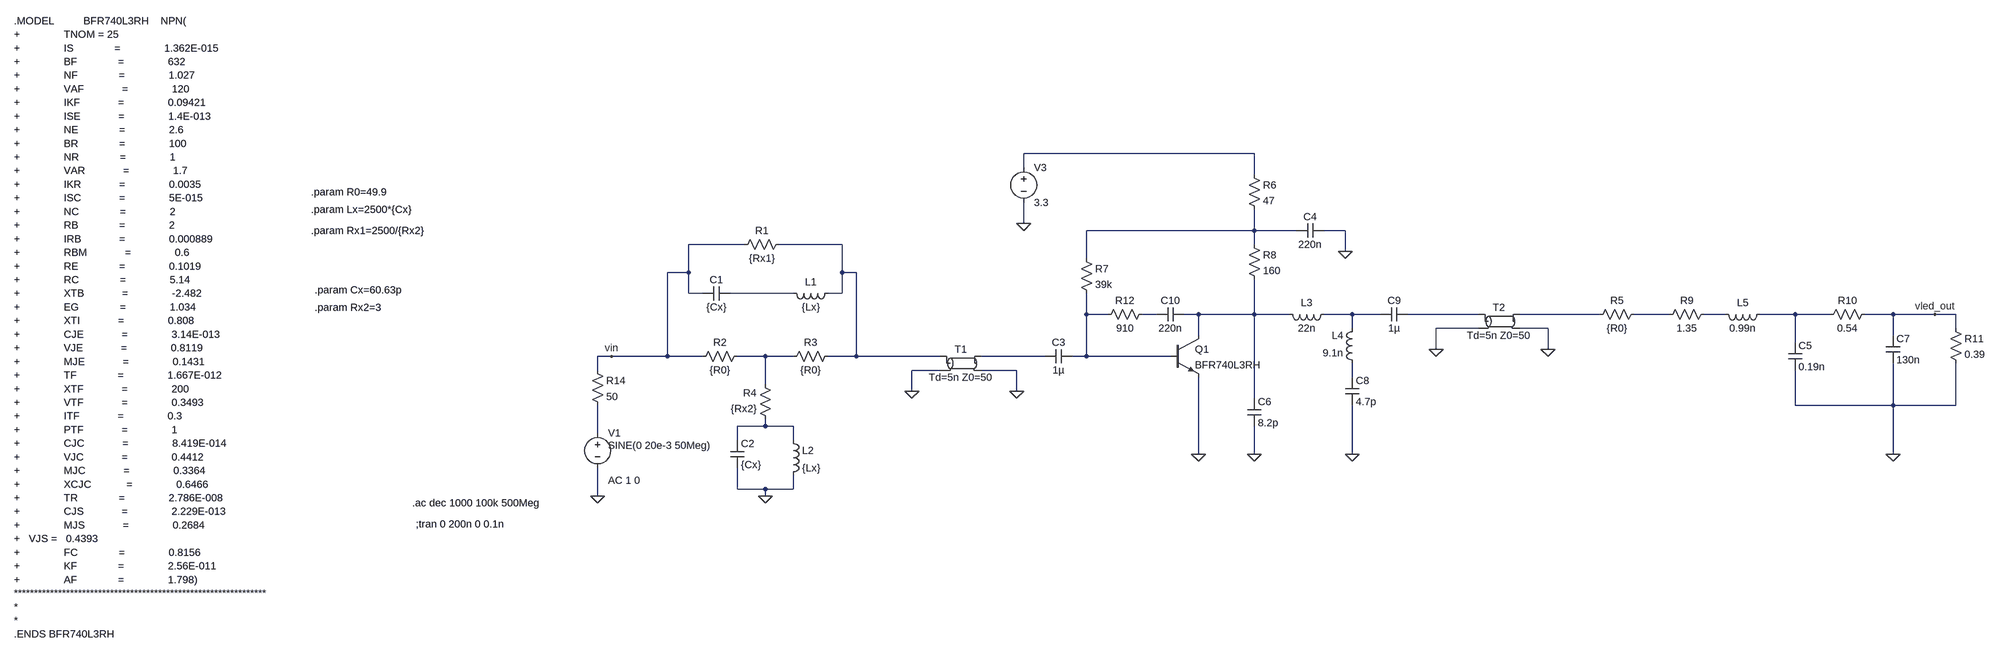
[diagram p0: schematic filtro_t_plus_amplifier_tx.asc]
filtro_t_plus_amplifier_tx.asc, the LTspice schematic file:
Version 4
SHEET 1 3516 848
WIRE 1232 -144 704 -144
WIRE 704 -112 704 -144
WIRE 1232 -96 1232 -144
WIRE 704 16 704 -32
WIRE 1232 32 1232 -16
WIRE 1232 32 848 32
WIRE 1328 32 1232 32
WIRE 1440 32 1392 32
WIRE 48 64 -80 64
WIRE 272 64 128 64
WIRE 1232 64 1232 32
WIRE 1440 80 1440 32
WIRE 848 96 848 32
WIRE -80 128 -80 64
WIRE -80 128 -128 128
WIRE 272 128 272 64
WIRE 304 128 272 128
WIRE -80 176 -80 128
WIRE -48 176 -80 176
WIRE 160 176 16 176
WIRE 272 176 272 128
WIRE 272 176 240 176
WIRE 848 224 848 176
WIRE 896 224 848 224
WIRE 1008 224 976 224
WIRE 1104 224 1072 224
WIRE 1232 224 1232 144
WIRE 1232 224 1104 224
WIRE 1312 224 1232 224
WIRE 1456 224 1392 224
WIRE 1520 224 1456 224
WIRE 1744 224 1584 224
WIRE 2032 224 1840 224
WIRE 2192 224 2112 224
WIRE 2320 224 2272 224
WIRE 2480 224 2400 224
WIRE 2560 224 2480 224
WIRE 2704 224 2640 224
WIRE 2800 224 2704 224
WIRE 2848 224 2800 224
WIRE 1456 256 1456 224
WIRE 1744 256 1648 256
WIRE 1904 256 1840 256
WIRE 2848 256 2848 224
WIRE 1104 272 1104 224
WIRE 2704 272 2704 224
WIRE 2480 288 2480 224
WIRE 1648 304 1648 256
WIRE 1904 304 1904 256
WIRE -256 320 -288 320
WIRE -128 320 -128 128
WIRE -128 320 -256 320
WIRE -48 320 -128 320
WIRE 96 320 32 320
WIRE 160 320 96 320
WIRE 304 320 304 128
WIRE 304 320 240 320
WIRE 512 320 304 320
WIRE 752 320 608 320
WIRE 848 320 848 224
WIRE 848 320 816 320
WIRE 1040 320 848 320
WIRE -288 352 -288 320
WIRE 512 352 448 352
WIRE 688 352 608 352
WIRE 1456 368 1456 336
WIRE 96 384 96 320
WIRE 448 400 448 352
WIRE 688 400 688 352
WIRE 1232 416 1232 224
WIRE 2480 432 2480 352
WIRE 2704 432 2704 336
WIRE 2704 432 2480 432
WIRE 2848 432 2848 336
WIRE 2848 432 2704 432
WIRE 96 480 96 464
WIRE 96 480 32 480
WIRE 160 480 96 480
WIRE -288 496 -288 432
WIRE 32 512 32 480
WIRE 160 512 160 480
WIRE 1104 544 1104 368
WIRE 1232 544 1232 480
WIRE 1456 544 1456 432
WIRE 2704 544 2704 432
WIRE 32 624 32 576
WIRE 96 624 32 624
WIRE 160 624 160 592
WIRE 160 624 96 624
WIRE -288 640 -288 576
WIRE 96 640 96 624
FLAG 96 640 0
FLAG -288 640 0
FLAG 2704 544 0
FLAG 2800 224 vled_out
FLAG 1104 544 0
FLAG 1232 544 0
FLAG 1456 544 0
FLAG 1440 80 0
FLAG 704 16 0
FLAG 448 400 0
FLAG 688 400 0
FLAG 1904 304 0
FLAG 1648 304 0
FLAG -256 320 vin
SYMBOL res 144 48 R90
WINDOW 0 0 56 VBottom 2
WINDOW 3 32 56 VTop 2
SYMATTR InstName R1
SYMATTR Value {Rx1}
SYMBOL cap 16 160 R90
WINDOW 0 0 32 VBottom 2
WINDOW 3 32 32 VTop 2
SYMATTR InstName C1
SYMATTR Value {Cx}
SYMBOL ind 256 160 R90
WINDOW 0 5 56 VBottom 2
WINDOW 3 32 56 VTop 2
SYMATTR InstName L1
SYMATTR Value {Lx}
SYMBOL res 48 304 R90
WINDOW 0 0 56 VBottom 2
WINDOW 3 32 56 VTop 2
SYMATTR InstName R2
SYMATTR Value {R0}
SYMBOL res 256 304 R90
WINDOW 0 0 56 VBottom 2
WINDOW 3 32 56 VTop 2
SYMATTR InstName R3
SYMATTR Value {R0}
SYMBOL res 112 480 R180
WINDOW 0 36 76 Left 2
WINDOW 3 36 40 Left 2
SYMATTR InstName R4
SYMATTR Value {Rx2}
SYMBOL cap 16 512 R0
SYMATTR InstName C2
SYMATTR Value {Cx}
SYMBOL ind 144 496 R0
SYMATTR InstName L2
SYMATTR Value {Lx}
SYMBOL voltage -288 480 R0
WINDOW 123 24 124 Left 2
WINDOW 39 24 152 Left 2
WINDOW 3 24 44 Left 2
SYMATTR Value2 AC 1 0
SYMATTR Value SINE(0 20e-3 50Meg)
SYMATTR InstName V1
SYMBOL res 2288 208 R90
WINDOW 0 0 56 VBottom 2
WINDOW 3 32 56 VTop 2
SYMATTR InstName R9
SYMATTR Value 1.35
SYMBOL cap 2464 288 R0
SYMATTR InstName C5
SYMATTR Value 0.19n
SYMBOL ind 2416 208 R90
WINDOW 0 5 56 VBottom 2
WINDOW 3 32 56 VTop 2
SYMATTR InstName L5
SYMATTR Value 0.99n
SYMBOL res 2656 208 R90
WINDOW 0 0 56 VBottom 2
WINDOW 3 32 56 VTop 2
SYMATTR InstName R10
SYMATTR Value 0.54
SYMBOL cap 2688 272 R0
SYMATTR InstName C7
SYMATTR Value 130n
SYMBOL res 2832 240 R0
SYMATTR InstName R11
SYMATTR Value 0.39
SYMBOL res 2128 208 R90
WINDOW 0 0 56 VBottom 2
WINDOW 3 32 56 VTop 2
SYMATTR InstName R5
SYMATTR Value {R0}
SYMBOL cap 816 304 R90
WINDOW 0 0 32 VBottom 2
WINDOW 3 32 32 VTop 2
SYMATTR InstName C3
SYMATTR Value 1µ
SYMBOL npn 1040 272 R0
SYMATTR InstName Q1
SYMATTR Value BFR740L3RH
SYMBOL res 1216 -112 R0
SYMATTR InstName R6
SYMATTR Value 47
SYMBOL res 832 80 R0
SYMATTR InstName R7
SYMATTR Value 39k
SYMBOL res 1216 48 R0
SYMATTR InstName R8
SYMATTR Value 160
SYMBOL res 992 208 R90
WINDOW 0 0 56 VBottom 2
WINDOW 3 32 56 VTop 2
SYMATTR InstName R12
SYMATTR Value 910
SYMBOL cap 1392 16 R90
WINDOW 0 0 32 VBottom 2
WINDOW 3 32 32 VTop 2
SYMATTR InstName C4
SYMATTR Value 220n
SYMBOL cap 1216 416 R0
SYMATTR InstName C6
SYMATTR Value 8.2p
SYMBOL cap 1440 368 R0
SYMATTR InstName C8
SYMATTR Value 4.7p
SYMBOL ind 1408 208 R90
WINDOW 0 5 56 VBottom 2
WINDOW 3 32 56 VTop 2
SYMATTR InstName L3
SYMATTR Value 22n
SYMBOL ind 1472 352 R180
WINDOW 0 36 80 Left 2
WINDOW 3 36 40 Left 2
SYMATTR InstName L4
SYMATTR Value 9.1n
SYMBOL cap 1584 208 R90
WINDOW 0 0 32 VBottom 2
WINDOW 3 32 32 VTop 2
SYMATTR InstName C9
SYMATTR Value 1µ
SYMBOL cap 1072 208 R90
WINDOW 0 0 32 VBottom 2
WINDOW 3 32 32 VTop 2
SYMATTR InstName C10
SYMATTR Value 220n
SYMBOL voltage 704 -128 R0
SYMATTR InstName V3
SYMATTR Value 3.3
SYMBOL res -304 336 R0
SYMATTR InstName R14
SYMATTR Value 50
SYMBOL tline 560 336 R0
SYMATTR InstName T1
SYMATTR Value Td=5n Z0=50
SYMBOL tline 1792 240 R0
SYMATTR InstName T2
SYMATTR Value Td=5n Z0=50
TEXT -1024 -16 Left 2 !.param Lx=2500*{Cx}
TEXT -1024 -56 Left 2 !.param R0=49.9
TEXT -792 656 Left 2 !.ac dec 1000 100k 500Meg
TEXT -1024 32 Left 2 !.param Rx1=2500/{Rx2}
TEXT -1016 168 Left 2 !.param Cx=60.63p
TEXT -1016 208 Left 2 !.param Rx2=3
TEXT -1824 -448 Left 2 !.MODEL          BFR740L3RH    NPN(\n+               TNOM = 25\n+               IS              =               1.362E-015\n+               BF              =               632\n+               NF              =               1.027\n+               VAF             =               120\n+               IKF             =               0.09421\n+               ISE             =               1.4E-013\n+               NE              =               2.6\n+               BR              =               100\n+               NR              =               1\n+               VAR             =               1.7\n+               IKR             =               0.0035\n+               ISC             =               5E-015\n+               NC              =               2\n+               RB              =               2\n+               IRB             =               0.000889\n+               RBM             =               0.6\n+               RE              =               0.1019\n+               RC              =               5.14\n+               XTB             =               -2.482\n+               EG              =               1.034\n+               XTI             =               0.808\n+               CJE             =               3.14E-013\n+               VJE             =               0.8119\n+               MJE             =               0.1431\n+               TF              =               1.667E-012\n+               XTF             =               200\n+               VTF             =               0.3493\n+               ITF             =               0.3\n+               PTF             =               1\n+               CJC             =               8.419E-014\n+               VJC             =               0.4412\n+               MJC             =               0.3364\n+               XCJC            =               0.6466\n+               TR              =               2.786E-008\n+               CJS             =               2.229E-013\n+               MJS             =               0.2684\n+   VJS =   0.4393\n+               FC              =               0.8156\n+               KF              =               2.56E-011\n+               AF              =               1.798)\n***************************************************************\n*\n*\n.ENDS BFR740L3RH
TEXT -784 704 Left 2 !;tran 0 200n 0 0.1n

The netlist it stands for:
* filtro_t_plus_amplifier_tx.asc
R1 N003 vin {Rx1}
C1 N004 vin {Cx}
L1 N003 N004 {Lx}
R2 N014 vin {R0}
R3 N003 N014 {R0}
R4 N017 N014 {Rx2}
C2 N017 0 {Cx}
L2 N017 0 {Lx}
V1 N018 0 SINE(0 20e-3 50Meg) AC 1 0
R9 N012 N011 1.35
C5 N013 0 0.19n
L5 N013 N012 0.99n
R10 vled_out N013 0.54
C7 vled_out 0 130n
R11 vled_out 0 0.39
R5 N011 N010 {R0}
C3 N005 N015 1µ
Q1 N007 N005 0 0 BFR740L3RH
R6 N001 N002 47
R7 N002 N005 39k
R8 N002 N007 160
R12 N006 N005 910
C4 0 N002 220n
C6 N007 0 8.2p
C8 N016 0 4.7p
L3 N008 N007 22n
L4 N016 N008 9.1n
C9 N009 N008 1µ
C10 N007 N006 220n
V3 N001 0 3.3
R14 vin N018 50
T1 N003 0 N015 0 Td=5n Z0=50
T2 N009 0 N010 0 Td=5n Z0=50
.model NPN NPN
.model PNP PNP
.lib standard.bjt
.param Lx=2500*{Cx}
.param R0=49.9
.ac dec 1000 100k 500Meg
.param Rx1=2500/{Rx2}
.param Cx=60.63p
.param Rx2=3
.MODEL          BFR740L3RH    NPN(
+               TNOM = 25
+               IS              =               1.362E-015
+               BF              =               632
+               NF              =               1.027
+               VAF             =               120
+               IKF             =               0.09421
+               ISE             =               1.4E-013
+               NE              =               2.6
+               BR              =               100
+               NR              =               1
+               VAR             =               1.7
+               IKR             =               0.0035
+               ISC             =               5E-015
+               NC              =               2
+               RB              =               2
+               IRB             =               0.000889
+               RBM             =               0.6
+               RE              =               0.1019
+               RC              =               5.14
+               XTB             =               -2.482
+               EG              =               1.034
+               XTI             =               0.808
+               CJE             =               3.14E-013
+               VJE             =               0.8119
+               MJE             =               0.1431
+               TF              =               1.667E-012
+               XTF             =               200
+               VTF             =               0.3493
+               ITF             =               0.3
+               PTF             =               1
+               CJC             =               8.419E-014
+               VJC             =               0.4412
+               MJC             =               0.3364
+               XCJC            =               0.6466
+               TR              =               2.786E-008
+               CJS             =               2.229E-013
+               MJS             =               0.2684
+   VJS =   0.4393
+               FC              =               0.8156
+               KF              =               2.56E-011
+               AF              =               1.798)
***************************************************************
*
*
.ENDS BFR740L3RH
;tran 0 200n 0 0.1n
.backanno
.end